# Altium schematic sheet CON_SD_HIROSE_609_0003_5.SchDoc: SD-CARD HIROSE 609_0003_5
size A4; Organization: Altium Limited.; Address1: Level 3, 12a Rodborough Rd; Address2: Frenchs Forest 2086; Address3: NSW; Address4: AUSTRALIA; SheetNumber: 1; SheetTotal: 100; PageSetup: Record=PageOptions|CenterHorizontal=True|CenterVertical=True|PrintScale=0.97|XCorrection=1.00|YCorrection=1.00|PrintKind=0|BorderSize=5000000|LeftOffset=0|BottomOffset=0|Orientation=2|PaperLength=1000|PaperWidth=1000|Scale=100|PaperSource=7|PrintQuality=-4|MediaType=1|DitherType=10|PaperKind=A4 (210 x 297mm)|PrintScaleMode=1
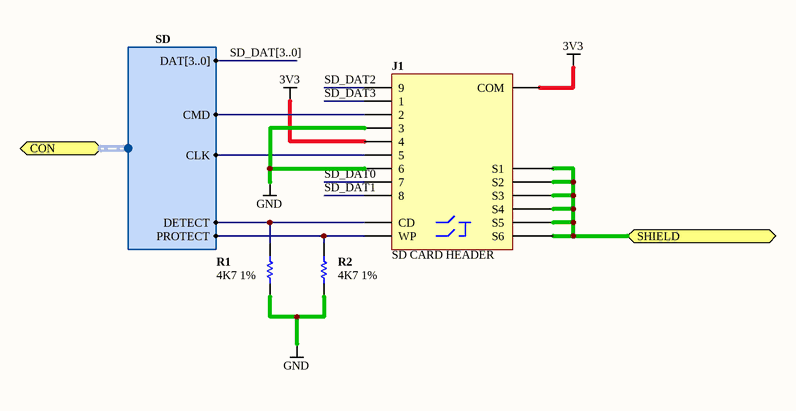
[diagram p0: CON_SD_HIROSE_609_0003_5.SchDoc]

## Parts
J1  SD CARD HEADER  [SD_CARD_HRS_609_0003_5]
R1  4K7 1%  [RESC1005-STAR]
R2  4K7 1%  [RESC1005-STAR]

## Ports
CON (harness SD), SHIELD

## Harnesses
SD: DAT[3..0], CMD, CLK, DETECT, PROTECT

## Nets
3V3: J1.4 J1.COM
GND: J1.3 J1.6 R1.1 R2.1
SD_DAT0: J1.7
SD_DAT1: J1.8
SD_DAT2: J1.9
SD_DAT3: J1.1
SHIELD: J1.S1 J1.S2 J1.S3 J1.S4 J1.S5 J1.S6 ; port SHIELD
NetJ1_2: J1.2 ; port CON.CMD
NetJ1_5: J1.5 ; port CON.CLK
NetJ1_CD: J1.CD R1.2 ; port CON.DETECT
NetJ1_WP: J1.WP R2.2 ; port CON.PROTECT

## Buses and harness runs
bus SD_DAT[3..0]

## Notes on the sheet
- Sheet Title
- Project Title
- Size:
- Date:
- A4
- Assy:
- Time:
- Revision:
- Sheet
- of
- File:

## Library data of the parts
J1 = D-300-0003: Secure Digital Card Socket; Connector type: SD CARD HEADER; Status: Production; Category: Connector
R1 R2 = D-100-0088: Resistor, 4K7 1% 0402 (1005); Power Rating: 63 mW; Resistance: 4.7 K; Category: Resistor; Mounting Technology: Surface Mount; Status: Production; Tolerance: 1 %